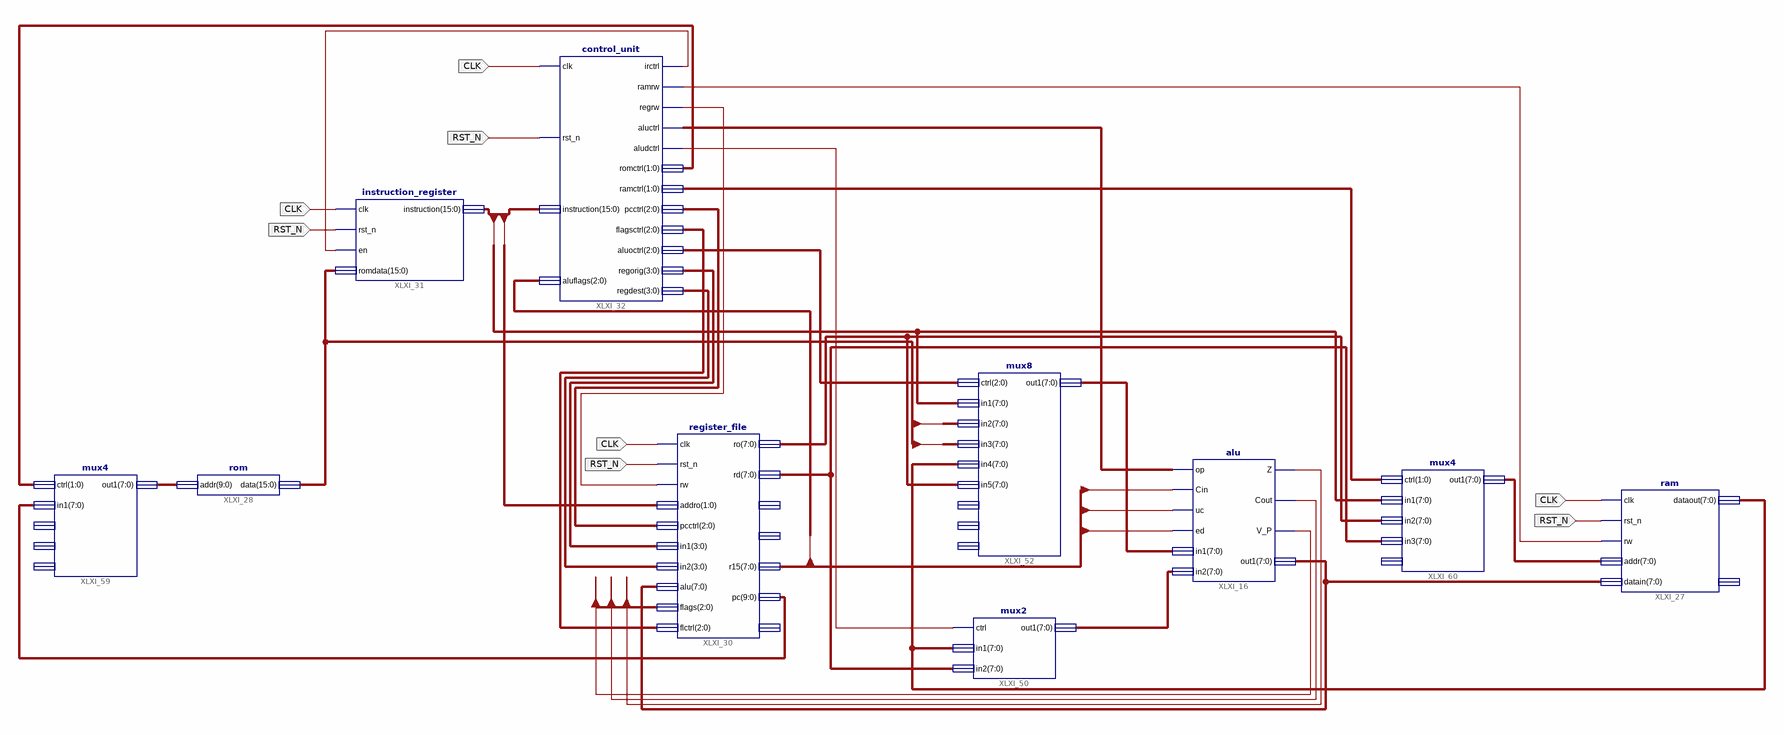
[diagram p0: schematic sheet 1]
// Xilinx ISE schematic top_level_sch.sch (spartan6) as structural Verilog: 10 symbols, 2 ports
module top_level_sch (
  input  RST_N,
  input  CLK
);

  wire XLXN_242, XLXN_256, XLXN_351, XLXN_352;
  wire [1:0] XLXN_245, XLXN_273;
  wire [2:0] flags, XLXN_211, XLXN_212, XLXN_243;
  wire [3:0] XLXN_209, XLXN_210, XLXN_225;
  wire [7:0] r15, XLXN_158, XLXN_220, XLXN_230, XLXN_257, XLXN_265, XLXN_296, XLXN_348;
  wire [9:0] XLXN_155, XLXN_202;
  wire [15:0] instruction, romdata;

  instruction_register XLXI_31 (.clk(CLK), .rst_n(RST_N), .en(XLXN_351), .romdata(romdata), .instruction(instruction));
  control_unit XLXI_32 (
    .clk(CLK), .rst_n(RST_N), .instruction(instruction), .aluflags(r15[7:5]), .irctrl(XLXN_351),
    .ramrw(XLXN_242), .regrw(XLXN_352), .aluctrl(XLXN_225), .aludctrl(XLXN_256), .romctrl(XLXN_273),
    .ramctrl(XLXN_245), .pcctrl(XLXN_211), .flagsctrl(XLXN_212), .aluoctrl(XLXN_243), .regorig(XLXN_209),
    .regdest(XLXN_210));
  rom XLXI_28 (.addr(XLXN_155), .data(romdata));
  ram XLXI_27 (
    .clk(CLK), .rst_n(RST_N), .rw(XLXN_242), .addr(XLXN_158), .datain(XLXN_230), .dataout(XLXN_296));  // open: ramdebug
  mux2 XLXI_50 (.ctrl(XLXN_256), .in1(XLXN_296), .in2(XLXN_257), .out1(XLXN_220));
  mux4 XLXI_59 (.ctrl(XLXN_273), .in1(XLXN_202), .out1(XLXN_155));  // open: in2, in3, in4
  mux4 XLXI_60 (.ctrl(XLXN_245), .in1(instruction[7:0]), .in2(XLXN_265), .in3(XLXN_257), .out1(XLXN_158));  // open: in4
  mux8 XLXI_52 (
    .ctrl(XLXN_243), .in1(instruction[7:0]), .in2(romdata[15:8]), .in3(romdata[7:0]), .in4(XLXN_296),
    .in5(XLXN_265), .out1(XLXN_348));  // open: in6, in7, in8
  alu XLXI_16 (
    .op(XLXN_225), .Cin(r15[7]), .uc(r15[2]), .ed(r15[1]), .in1(XLXN_348), .in2(XLXN_220), .Z(flags[2]),
    .Cout(flags[1]), .V_P(flags[0]), .out1(XLXN_230));
  register_file XLXI_30 (
    .clk(CLK), .rst_n(RST_N), .rw(XLXN_352), .addro(instruction[9:8]), .pcctrl(XLXN_211), .in1(XLXN_209),
    .in2(XLXN_210), .alu(XLXN_230), .flags(flags), .flctrl(XLXN_212), .ro(XLXN_265), .rd(XLXN_257),
    .r15(r15), .pc(XLXN_202));  // open: r13, r14, regdebug
endmodule
